# EAGLE design WRO_2025 (EAGLE 9.6.2)
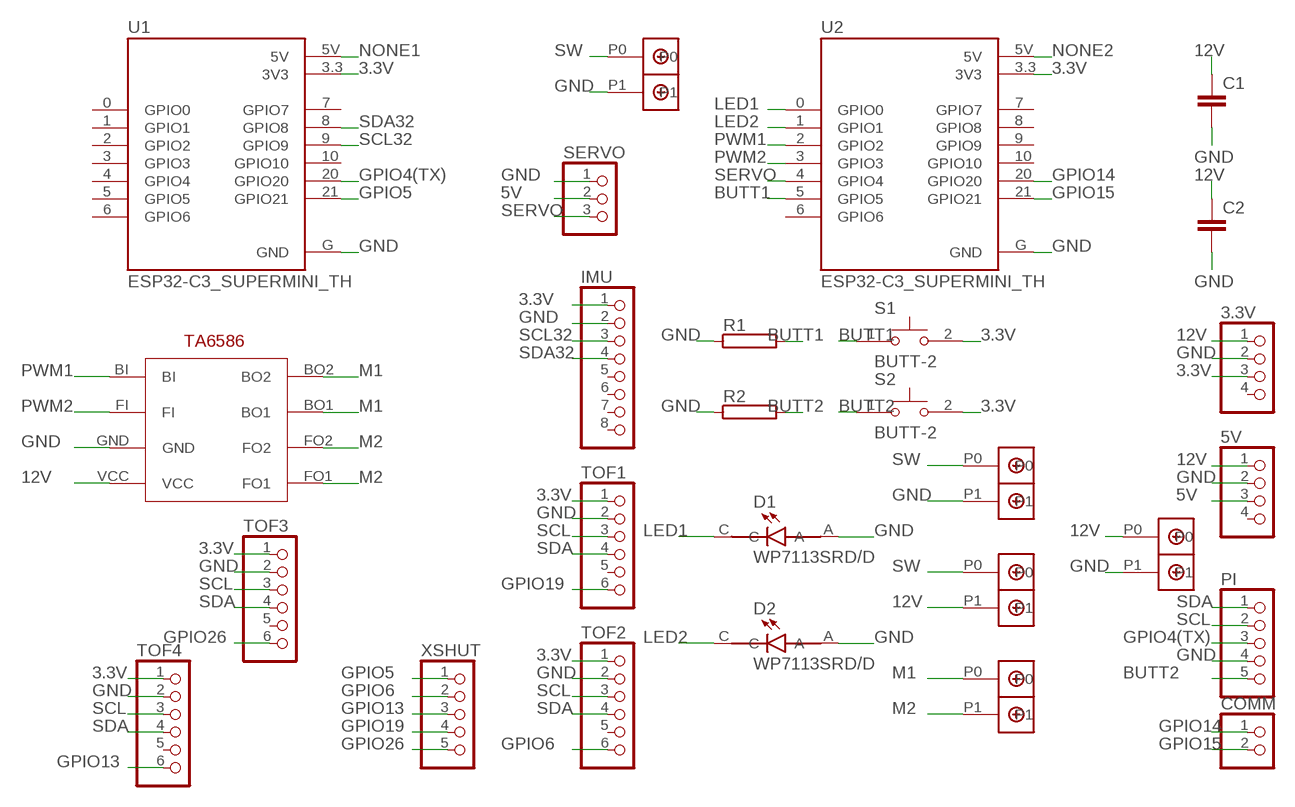
[diagram p0: schematic, sheet 1]

## Parts
3.3V  PINHD-1X4  [1X04]
5V  PINHD-1X4  [1X04]
C1  C2,5-3  [C2.5-3]
C2  C2,5-3  [C2.5-3]
COMM  PINHD-1X2  [1X02]
D1  WP7113SRD/D  [LED_WP7113SRD/D]
D2  WP7113SRD/D  [LED_WP7113SRD/D]
IMU  PINHD-1X8  [1X08]
PI  PINHD-1X5  [1X05]
R1  RHPS58  [HPS58]
R2  RHPS58  [HPS58]
S1  BUTT-2  [SW_BUTT-2]
S2  BUTT-2  [SW_BUTT-2]
SERVO  PINHD-1X3  [1X03]
TOF1  PINHD-1X6  [1X06]
TOF2  PINHD-1X6  [1X06]
TOF3  PINHD-1X6  [1X06]
TOF4  PINHD-1X6  [1X06]
U1  ESP32-C3_SUPERMINI_TH  [MODULE_ESP32-C3_SUPERMINI_TH]
U2  ESP32-C3_SUPERMINI_TH  [MODULE_ESP32-C3_SUPERMINI_TH]
U$1  DBCONN-1X2  [DBCONN-1X2]
U$2  DBCONN-1X2  [DBCONN-1X2]
U$3  DBCONN-1X2  [DBCONN-1X2]
U$4  TA6586  [TA6586-FOOTPRINT]
U$5  DBCONN-1X2  [DBCONN-1X2]
U$6  DBCONN-1X2  [DBCONN-1X2]
XSHUT  PINHD-1X5  [1X05]

## Nets
3.3V: 3.3V.3 IMU.1 S1.2 S2.2 TOF1.1 TOF2.1 TOF3.1 TOF4.1 U1.3.3(3V3) U2.3.3(3V3)
5V: 5V.3 SERVO.2
12V: 3.3V.1 5V.1 C1.1 C2.1 U$2.P1 U$4.VCC U$5.P0
BUTT1: R1.2 S1.1 U2.5(GPIO5)
BUTT2: PI.5 R2.2 S2.1
GND: 3.3V.2 5V.2 C1.2 C2.2 D1.A D2.A IMU.2 PI.4 R1.1 R2.1 SERVO.1 TOF1.2 TOF2.2 TOF3.2 TOF4.2 U1.G(GND) U2.G(GND) U$1.P1 U$4.GND U$5.P1 U$6.P1
GPIO4(TX): PI.3 U1.20(GPIO20)
GPIO5: U1.21(GPIO21) XSHUT.1
GPIO6: TOF2.6 XSHUT.2
GPIO13: TOF4.6 XSHUT.3
GPIO14: COMM.1 U2.20(GPIO20)
GPIO15: COMM.2 U2.21(GPIO21)
GPIO19: TOF1.6 XSHUT.4
GPIO26: TOF3.6 XSHUT.5
LED1: D1.C U2.0(GPIO0)
LED2: D2.C U2.1(GPIO1)
M1: U$3.P0 U$4.BO1 U$4.BO2
M2: U$3.P1 U$4.FO1 U$4.FO2
NONE1: U1.5V
NONE2: U2.5V
PWM1: U2.2(GPIO2) U$4.BI
PWM2: U2.3(GPIO3) U$4.FI
SCL: PI.2 TOF1.3 TOF2.3 TOF3.3 TOF4.3
SCL32: IMU.3 U1.9(GPIO9)
SDA: PI.1 TOF1.4 TOF2.4 TOF3.4 TOF4.4
SDA32: IMU.4 U1.8(GPIO8)
SERVO: SERVO.3 U2.4(GPIO4)
SW: U$1.P0 U$2.P0 U$6.P0
Unconnected: 3.3V.4 5V.4 IMU.5 IMU.6 IMU.7 IMU.8 TOF1.5 TOF2.5 TOF3.5 TOF4.5 U1.0(GPIO0) U1.1(GPIO1) U1.2(GPIO2) U1.3(GPIO3) U1.4(GPIO4) U1.5(GPIO5) U1.6(GPIO6) U1.7(GPIO7) U1.10(GPIO10) U2.6(GPIO6) U2.7(GPIO7) U2.8(GPIO8) U2.9(GPIO9) U2.10(GPIO10)

## Library data of the parts
3.3V 5V = pinhead:PINHD-1X4: PIN HEADER
C1 C2 = capacitor-wima:C: CAPACITOR naming: grid - package width
COMM = pinhead:PINHD-1X2: PIN HEADER
D1 D2 = WP7113SRD_D:WP7113SRD/D: Red T-1 3/4 5 mm 30° Tinted Diffused 600 mcd 1.85 V Solid State LED Through Hole Check availability <https://pricing.snapeda.com/parts/WP7113SRD/D/Kingbright/view-part?ref=eda>; AVAILABILITY: In Stock; CHECK_PRICES: https://www.snapeda.com/parts/WP7113SRD/D/Kingbright/view-part/?ref=eda; DESCRIPTION: Red 640nm LED Indication - Discrete 1.85V Radial; MF: Kingbright; MP: WP7113SRD/D; PACKAGE: Radial Kingbright; PRICE: None; SNAPEDA_LINK: https://www.snapeda.com/parts/WP7113SRD/D/Kingbright/view-part/?ref=snap
IMU = pinhead:PINHD-1X8: PIN HEADER
PI XSHUT = pinhead:PINHD-1X5: PIN HEADER
R1 R2 = resistor-power:R: Power Resitor; OC_FARNELL: unknown; OC_NEWARK: unknown
S1 S2 = BUTT-2:BUTT-2: Tactile Switches MINI PUSH BUTTON SWITCH 2-PIN QTY. 4 Check availability <https://pricing.snapeda.com/parts/BUTT-2/Gravitech/view-part?ref=eda>; AVAILABILITY: Not in stock; CHECK_PRICES: https://www.snapeda.com/parts/BUTT-2/Gravitech/view-part/?ref=eda; DESCRIPTION: Tactile Switches MINI PUSH BUTTON SWITCH 2-PIN QTY. 4; MF: Gravitech; MP: BUTT-2; PACKAGE: None; PRICE: None; SNAPEDA_LINK: https://www.snapeda.com/parts/BUTT-2/Gravitech/view-part/?ref=snap
SERVO = pinhead:PINHD-1X3: PIN HEADER
TOF1-TOF4 = pinhead:PINHD-1X6: PIN HEADER
U1 U2 = ESP32-C3_SUPERMINI_TH:ESP32-C3_SUPERMINI_TH: Check availability <https://pricing.snapeda.com/parts/ESP32-C3%20SuperMini_TH/Espressif%20Systems/view-part?ref=eda>; AVAILABILITY: Not in stock; CHECK_PRICES: https://www.snapeda.com/parts/ESP32-C3%20SuperMini_TH/Espressif+Systems/view-part/?ref=eda; DESCRIPTION: Super tiny ESP32-C3 board; MF: Espressif Systems; MP: ESP32-C3 SuperMini_TH; PACKAGE: Package; PRICE: None; SNAPEDA_LINK: https://www.snapeda.com/parts/ESP32-C3%20SuperMini_TH/Espressif+Systems/view-part/?ref=snap
U$1-U$3 U$5 U$6 = Terminal Block Connector:DBCONN-1X2
U$4 = TA6586:TA6586: Check availability <https://pricing.snapeda.com/parts/TA6586/Wuxi/view-part?ref=eda>; AVAILABILITY: Not in stock; CHECK_PRICES: https://www.snapeda.com/parts/TA6586/Wuxi/view-part/?ref=eda; DESCRIPTION: DC Bidirectional motor driving circuit; MF: Wuxi; MP: TA6586; PACKAGE: Package; PRICE: None; SNAPEDA_LINK: https://www.snapeda.com/parts/TA6586/Wuxi/view-part/?ref=snap

## Board
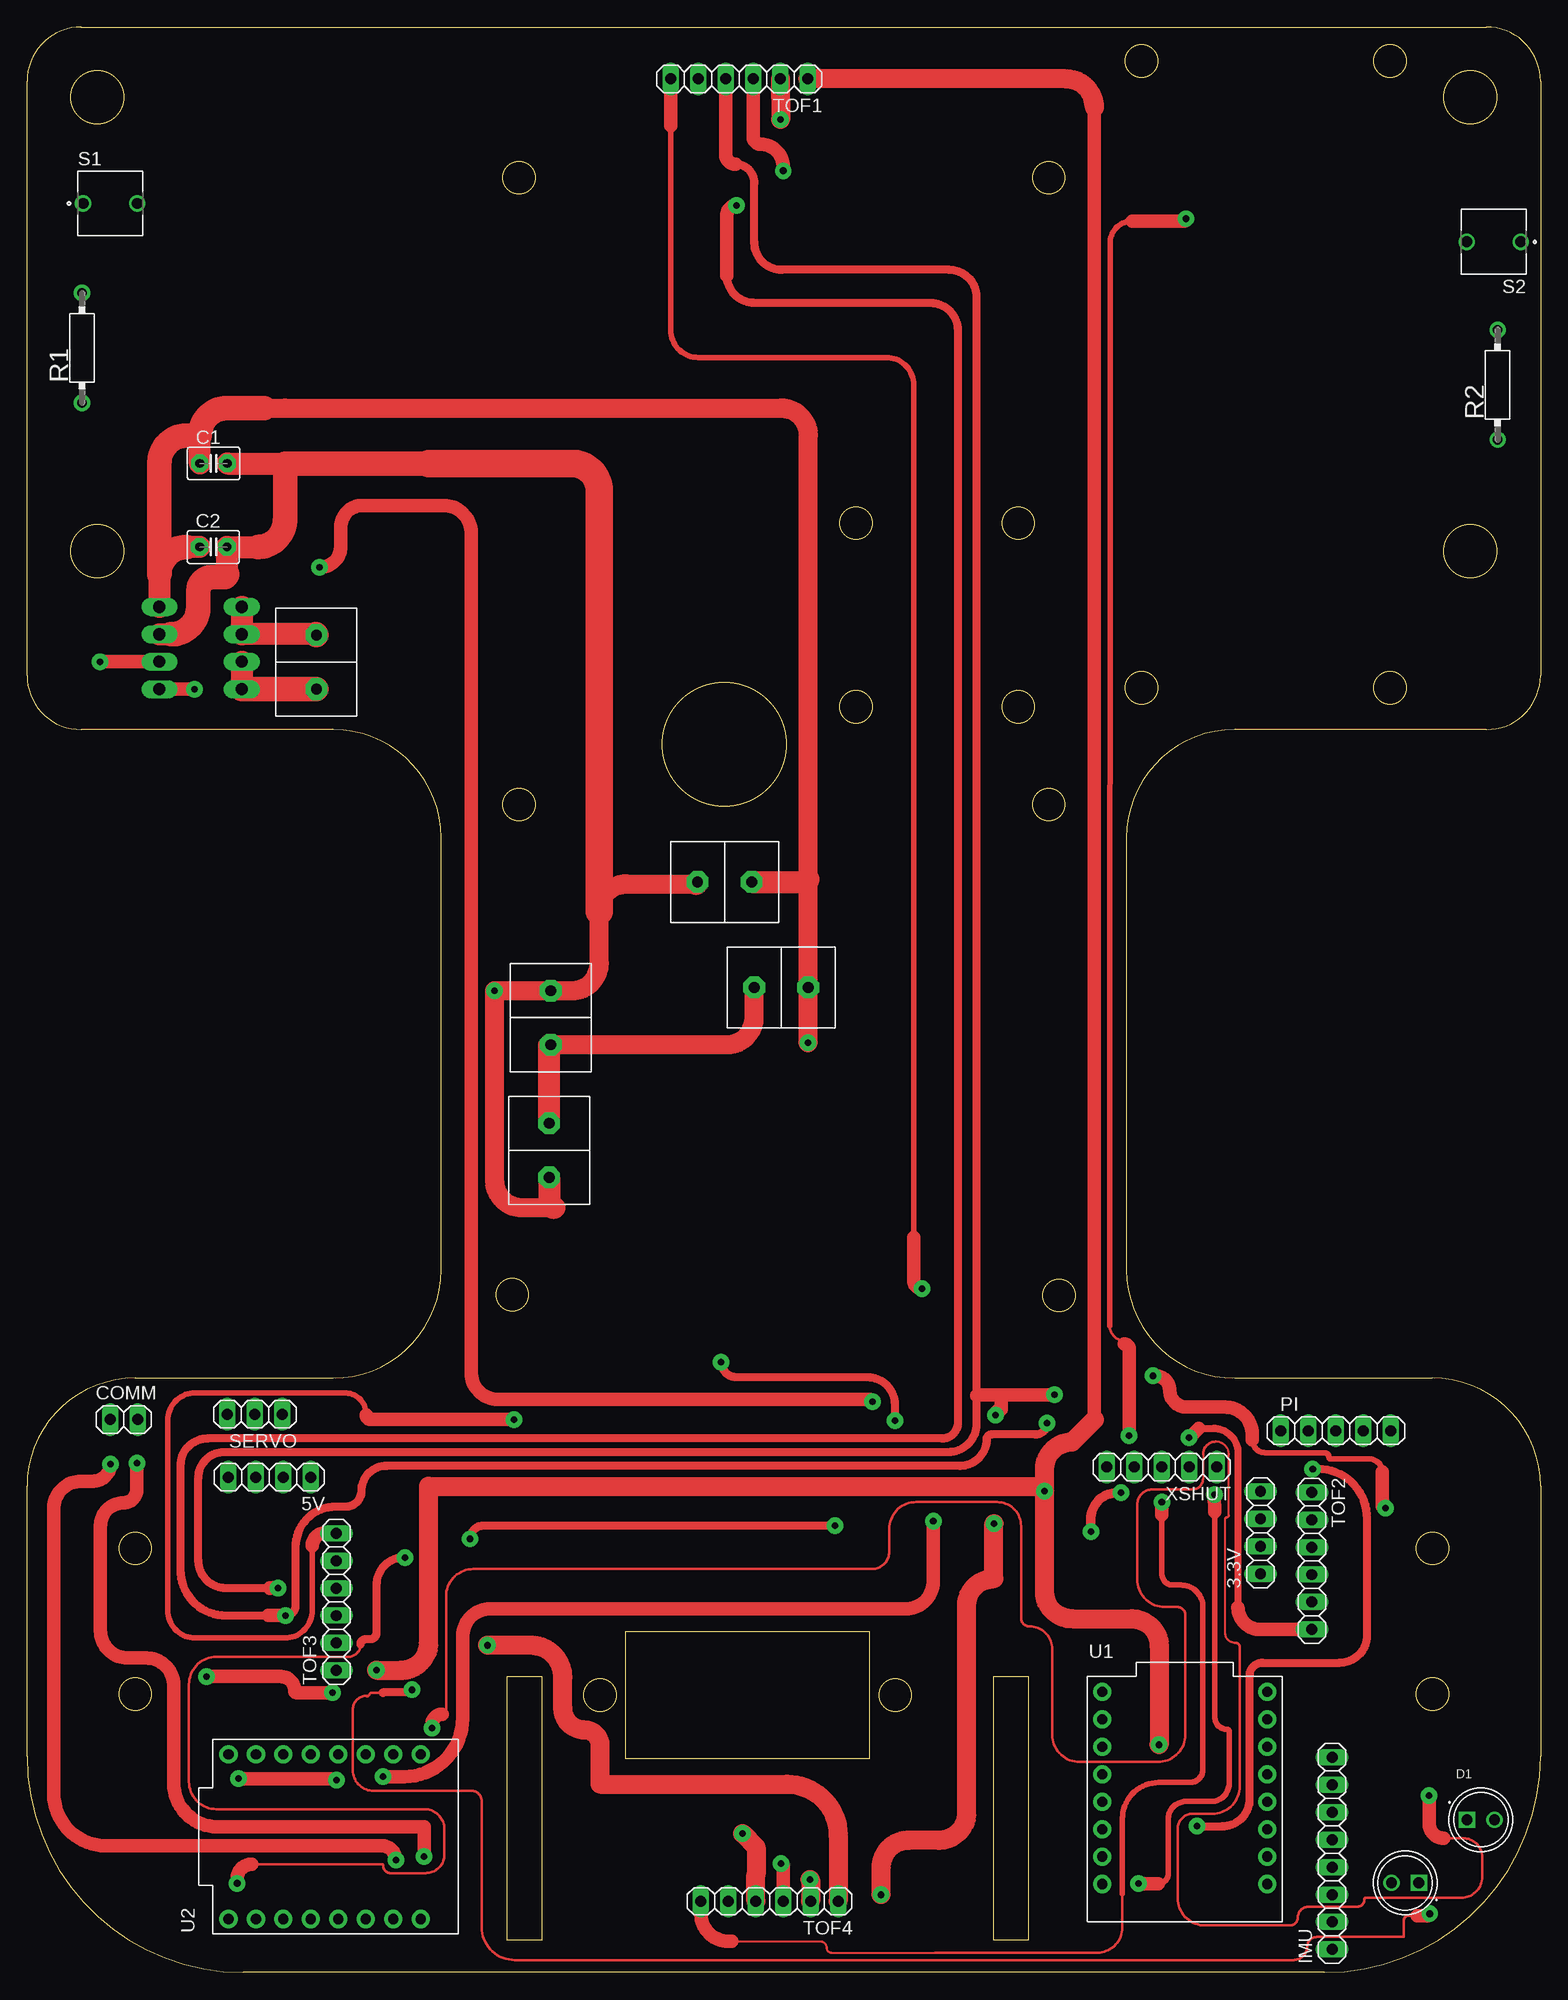
[diagram p1: board, top side]
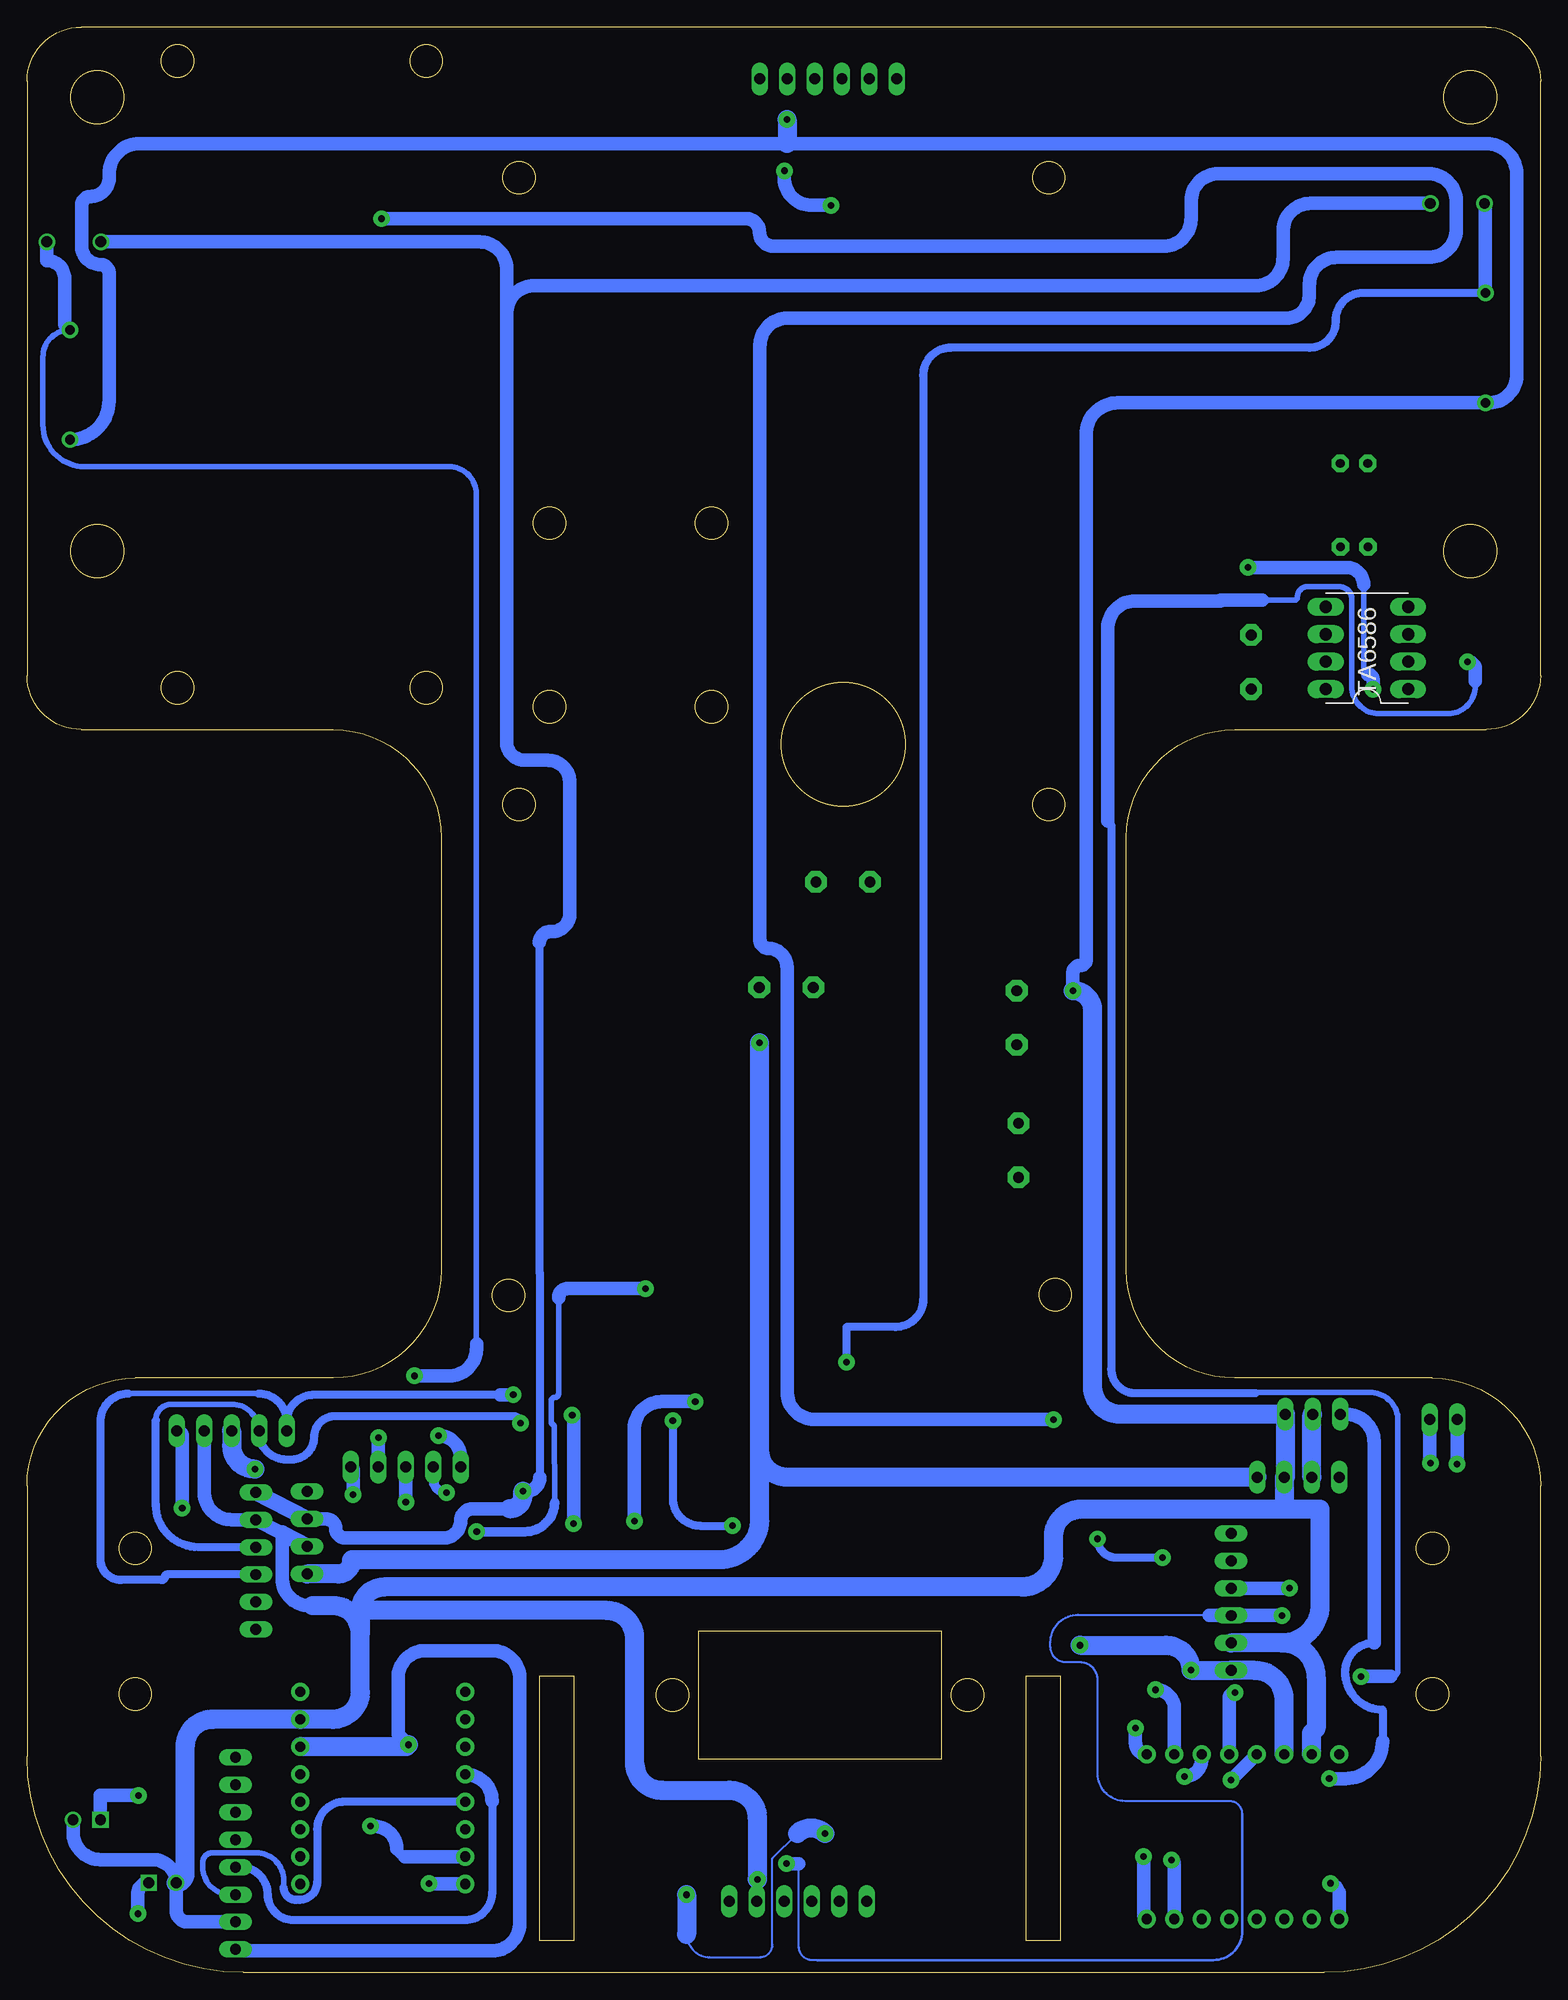
[diagram p2: board, bottom side, seen from below]

Size 140 x 180 mm. Coordinates in mm from the lower left corner, seen from the top.
Outline: 44.4,27.4 47.6,27.4 47.6,3 44.4,3 44.4,27.4
Outline: 89.4,27.4 92.6,27.4 92.6,3 89.4,3 89.4,27.4
Outline: 55.4,31.57 77.9,31.57 77.9,19.77 55.4,19.77 55.4,31.57
Outline: 101.69,105 101.69,65 arc90 111.69,55 130,55 arc-90 140,45 140,20 arc-90 120,0 20,0 arc-90 0,20 0,45 arc-90 10,55 28.31,55 arc90 38.31,65 38.31,105 arc90 28.31,115 5,115 arc-90 0,120 0,175 arc-90 5,180 135,180 arc-90 140,175 140,120 arc-90 135,115 111.69,115 arc90 101.69,105
Outline: circle at 80.3,25.67 radius 1.5
Outline: circle at 130,25.75 radius 1.5
Outline: circle at 10,25.75 radius 1.5
Outline: circle at 10,39.25 radius 1.5
Outline: circle at 103.08,118.86 radius 1.5
Outline: circle at 94.5,166.05 radius 1.5
Outline: circle at 45.5,166.05 radius 1.5
Outline: circle at 130,39.25 radius 1.5
Outline: circle at 133.5,173.5 radius 2.45
Outline: circle at 133.5,131.5 radius 2.45
Outline: circle at 6.5,131.5 radius 2.45
Outline: circle at 6.5,173.5 radius 2.45
Outline: circle at 53,25.67 radius 1.5
Outline: circle at 126.08,176.86 radius 1.5
Outline: circle at 45.5,108.05 radius 1.5
Outline: circle at 126.08,118.86 radius 1.5
Outline: circle at 91.68,117.1 radius 1.5
Outline: circle at 76.68,134.1 radius 1.5
Outline: circle at 91.68,134.1 radius 1.5
Outline: circle at 103.08,176.86 radius 1.5
Copper layers (1*16): Top 0.035mm / dielectric 1.5mm / Bottom 0.035mm
Design rules "default *": minimum track width 6mil, minimum drill 0.35mm, track to track 0.4mm, track to pad 0.4mm, pad to pad 6mil, via to via 6mil, smd to smd 6mil, copper to edge 40mil, drill to drill 6mil, minimum pad ring 10mil, minimum via ring 8mil, stop-mask expansion 4mil, vias tented up to drill 0mil, thermal gap 10mil

### Footprints (pad centres in the part's own frame; a part is rotated, then mirrored left to right if it is on the bottom)
1X04 = drill 1.016 long: 1 -3.81,0; 2 -1.27,0; 3 1.27,0; 4 3.81,0
C2.5-3 = drill 0.813 pad 1.6 octagon: 1 -1.27,0; 2 1.27,0
1X02 = drill 1.016 long: 1 -1.27,0; 2 1.27,0
LED_WP7113SRD/D = drill 1: A 1.27,0 | drill 1 square: C -1.27,0
1X08 = drill 1.016 long: 1 -8.89,0; 2 -6.35,0; 3 -3.81,0; 4 -1.27,0; 5 1.27,0; 6 3.81,0; 7 6.35,0; 8 8.89,0
1X05 = drill 1.016 long: 1 -5.08,0; 2 -2.54,0; 3 0,0; 4 2.54,0; 5 5.08,0
HPS58 = drill 0.9 pad 1.5: 1 -5.08,0; 2 5.08,0
SW_BUTT-2 = drill 1: 1 -2.5,0; 2 2.5,0
1X03 = drill 1.016 long: 1 -2.54,0; 2 0,0; 3 2.54,0
1X06 = drill 1.016 long: 1 -6.35,0; 2 -3.81,0; 3 -1.27,0; 4 1.27,0; 5 3.81,0; 6 6.35,0
MODULE_ESP32-C3_SUPERMINI_TH = drill 0.94 pad 1.676: 0 7.62,-7.88; 1 7.62,-5.34; 2 7.62,-2.8; 3 7.62,-0.26; 3.3 7.62,4.82; 4 7.62,2.28; 5 -7.62,9.9; 5V 7.62,9.9; 6 -7.62,7.36; 7 -7.62,4.82; 8 -7.62,2.28; 9 -7.62,-0.26; 10 -7.62,-2.8; 20 -7.62,-5.34; 21 -7.62,-7.88; G 7.62,7.36
DBCONN-1X2 = drill 1 pad 2 octagon: P0 -2.54,0; P1 2.46,0
TA6586-FOOTPRINT = drill 1.118 long: BI -12.7,6.35; BO1 -5.08,3.81; BO2 -5.08,6.35; FI -12.7,3.81; FO1 -5.08,-1.27; FO2 -5.08,1.27; GND -12.7,1.27; VCC -12.7,-1.27

### Placement (x,y rotation side)
3.3V  114.1,40.69 90 top
5V  22.42,45.83 180 top
C1  17.25,139.62 0 top
C2  17.23,131.89 0 top
COMM  8.96,51.17 0 top
D1  134.48,14.14 0 top
D2  127.48,8.29 180 top
IMU  120.72,11.02 90 top
PI  121.07,50.11 0 top
R1  5.09,150.31 90 top
R2  136.03,146.9 90 top
S1  7.69,163.68 0 top
S2  135.67,160.12 180 top
SERVO  21.07,51.64 180 top
TOF1  65.89,175.2 180 top
TOF2  118.84,38.08 270 top
TOF3  28.61,34.29 90 top
TOF4  68.68,6.59 180 top
U1  107.09,16.06 0 top
U2  28.53,12.57 90 top
U$1  48.45,88.38 90 top
U$2  69.81,91.14 0 top
U$3  26.77,121.29 90 top
U$4  24.95,125.08 180 bottom
U$5  64.48,100.9 180 top
U$6  48.29,76.03 270 top
XSHUT  104.96,46.76 180 top

### Tracks (layer width: path | path; a pad name or v marks a point on that pad's centre or on a via)
3.3V  (via drill 0.61 pad 1.52)
  Top 1.27: 98.73,51.13 98.73,172.57
  Top 1.778: 98.73,51.13 96.68,49.08 arc-90 96.66,49.08 arc90 94.13,46.55 v94.13,44.54 | v104.72,21.07 v104.73,21.08 104.73,30.18 arc90 102.19,32.72 96.67,32.72 arc-90 94.13,35.26 v94.13,44.54 | 98.73,172.57 arc90 96.1,175.2 TOF1.1 | TOF4.1 75.03,12.69 arc90 70.29,17.43 53.02,17.43 53.02,21 arc90 51.59,22.43 arc-90 49.56,24.46 49.56,27.32 arc90 46.61,30.27 v42.59,30.27 | 37.15,30.5 arc-90 34.6,27.96 | v32.33,27.96 34.6,27.96 | 34.6,27.96 arc90 37.15,30.5 | 37.15,30.5 37.15,44.98 93.68,44.98 arc-90 v94.13,44.54
  Bottom 0.762: 92.61,95.29 92.61,64.76 92.57,64.72 92.57,45.8 92.61,45.76
  Bottom 1.27: S1.2 21.28,163.68 arc-90 23.82,161.14 23.82,158.62 arc90 26.36,156.08 93.09,156.08 arc-90 95.63,153.54 | 95.63,153.54 95.63,113.85 arc-90 93.94,112.16 91.86,112.16 arc90 89.79,110.08 89.79,98 arc90 91.48,96.31 91.59,96.31 arc-90 92.61,95.29 | S2.2 98.17,160.12 arc90 95.63,157.58 95.63,153.54 | IMU.1 arc-90 120.58,2 96.97,2 arc-90 94.44,4.54 94.44,27.24 arc-90 96.97,29.78 103.14,29.78 arc-90 105.68,27.24 105.68,22.03 v104.72,21.07 | 95.36,42.9 98.76,42.9 arc-90 99.9,41.77 arc90 101.46,40.2 110.59,40.2 arc90 111.45,41.06 arc-90 112.35,41.96 3.3V.3 | 92.57,45.8 arc90 93.87,44.5 94.13,44.5
  Bottom 1.524: 3.3V.3 TOF2.1
  Bottom 1.778: U2.3.3 23.71,25.25 arc-90 26.41,27.94 TOF3.1 arc-90 28.64,27.96 v32.33,27.96 arc-90 34.64,30.27 v42.59,30.27 | v104.72,21.07 arc-90 104.9,20.88 U1.3.3 | 95.36,42.9 arc-90 94.13,44.13 94.13,44.5 v94.13,44.54
5V
  Bottom 1.778: 5V.3 21.14,51.57 arc90 SERVO.2
12V  (via drill 0.61 pad 1.52)
  Top 1.778: v72.24,86.03 72.24,91.12 arc-90 U$2.P1 72.27,101.16 72.27,142.21 arc90 69.73,144.75 23.86,144.75 21.94,144.75 21.06,144.75
  Top 2.032: U$5.P0 72.01,100.9 arc90 72.27,101.16 | C1.1 15.98,142.21 | C2.1 14.79,131.9 | 12.24,129.35 U$4.VCC
  Top 2.286: 21.94,144.75 18.52,144.75 arc90 15.98,142.21 14.79,142.21 arc90 12.24,139.67 12.24,129.35 arc-90 14.79,131.9
  Bottom 1.778: 5V.1 69.7,45.83 arc90 72.24,48.37 | 72.24,48.37 v72.24,86.03 | 72.24,48.37 72.24,41.9 arc90 75.96,38.18 109.9,38.18 arc-90 109.98,38.09 arc90 111.2,36.88 3.3V.1
BUTT1  (via drill 0.61 pad 1.52)
  Top 0.254: 30.83,30.32 arc-90 29.71,29.21 17.52,29.21 arc90 14.98,26.66 14.98,17.66 arc90 17.52,15.11 36.76,15.11 arc-90 38.62,13.26 38.62,10.94 arc-90 36.87,9.2 33.63,9.2 arc-90 32.94,9.89 arc90 32.8,10.03 20.79,10.03
  Top 0.762: v64.21,56.48 arc90 65.61,55.08 77.73,55.08 arc-90 80.27,52.54 v80.27,51.06 | v74.73,41.34 42.2,41.34 arc90 v40.98,40.12 | v34.95,38.4 34.86,38.4 arc90 32.32,35.85 32.32,31.43 arc-90 31.73,30.83 31.34,30.83 arc90 30.83,30.32
  Top 1.27: 20.79,10.03 arc90 19.44,8.68 v19.44,8.25
  Bottom 0.762: R1.2 16.42,155.39 arc-90 18.96,152.85 18.96,152.73 arc90 21.36,150.33 54.57,150.33 arc-90 57.11,147.79 57.11,62.27 arc90 59.65,59.73 64.21,59.73 v64.21,56.48 | v80.27,51.06 80.27,43.88 arc-90 77.73,41.34 v74.73,41.34 | v40.98,40.12 arc-90 39.26,38.4 v34.95,38.4
  Bottom 1.016: v19.44,8.25 arc90 18.63,7.44
  Bottom 1.27: R1.2 5.09,163.58 arc-90 S1.1 | 18.63,7.44 U2.5
BUTT2  (via drill 0.61 pad 1.52)
  Top 0.508: 113.33,49.29 arc90 114.53,48.09 119.98,48.09 arc-90 120.44,47.64 arc90 120.54,47.53 124.13,47.53 arc-90 125.36,46.3
  Top 1.27: v104.15,55.2 104.36,55.2 arc-90 105.7,53.86 arc90 107.25,52.31 110.79,52.31 arc-90 113.33,49.77 113.33,49.29 | 125.36,46.3 125.36,43.24 arc90 v125.64,42.96
  Bottom 0.508: R2.2 arc-90 138.53,149.48 138.53,143.19 arc-90 134.67,139.32 100.96,139.32 arc90 98.44,136.81 98.44,58.17 98.42,58.14
  Bottom 1.27: R2.2 136.52,152.47 136.52,156.74 arc-90 138.17,158.39 S2.1 | 98.42,58.14 98.42,57.74 arc90 100.96,55.2 v104.15,55.2 | v125.64,42.96 125.64,49.61 arc-90 PI.5
GND  (via drill 0.61 pad 1.52)
  Top 1.778: 48.78,70.75 45.8,70.75 arc-90 43.26,73.29 v43.26,90.85 U$1.P1 arc-90 U$1.P1 50.39,90.84 arc90 52.93,93.38 52.93,98.18 arc-90 55.47,100.72 61.84,100.72 | TOF1.2 v69.7,171.43 | v72.44,8.61 72.49,8.56 TOF4.2
  Top 2.032: 61.84,100.72 arc90 U$5.P1 | U$6.P1 48.29,71.23 arc90 48.78,70.75 | C1.2 23.86,139.62 | 21.32,131.9 C2.2 18.5,129.4 | U$4.GND 13.32,123.81
  Top 2.286: 37.14,139.62 23.86,139.62 23.86,134.44 arc-90 21.32,131.9 | 13.32,123.81 arc90 15.86,126.35 15.86,127.87 arc-90 17.07,129.08 18.19,129.08 arc90 18.5,129.4
  Top 2.54: 37.14,139.62 50.39,139.62 arc-90 52.93,137.08 52.93,98.18
  Bottom 1.27: v43.26,90.85 43.26,92.47 arc90 42.55,93.18 arc-90 42.04,93.7 42.04,142.3 arc90 39.11,145.23 R1.1 4.75,145.23 arc-90 2.21,147.77 2.21,166.41 arc-90 5.01,169.21 69.7,169.21 129.61,169.21 arc-90 132.41,166.41 132.41,166.02 arc90 134.1,164.32 arc-90 134.95,163.47 134.95,159.75 arc-90 133.22,158.02 arc90 132.41,157.2 132.41,145.44 arc90 R2.1 | 113.58,33.94 113.87,33.94 arc90 116.41,36.48 116.41,40.63 TOF2.2 121.07,41.89 arc90 123.61,44.43 PI.4 | IMU.2 125.12,4.67 arc90 126.21,5.76 D2.A arc-90 128.36,10.44 133.21,10.44 arc90 135.75,12.98 D1.A
  Bottom 1.524: 3.3V.2 116.41,40.63
  Bottom 1.778: 23.93,30.48 TOF3.2 | 23.69,42.88 5V.2 arc-90 23.61,45.9 SERVO.1 38.86,51.64 arc90 41.43,54.22 41.43,89.02 arc-90 v43.26,90.85 | 23.93,30.48 arc-90 20.4,34.01 20.4,42.88 23.69,42.88 | U2.G 21.17,22.16 20.75,22.58 20.75,27.37 arc-90 23.87,30.48 23.93,30.48 | 23.69,42.88 42.5,42.88 arc-90 45.04,40.34 45.04,38.56 arc90 47.95,35.66 107,35.66 arc-90 109.18,33.48 | D2.A arc-90 125.39,9.12 125.39,20.88 arc90 122.84,23.42 U1.G 111.72,23.42 arc-90 109.18,25.96 109.18,31.4 | 109.18,31.4 arc-90 111.72,33.94 113.58,33.94 | 109.18,33.48 109.18,31.4 | 109.18,33.48 86.34,33.48 arc90 83.8,30.94 83.8,19.4 arc-90 81.26,16.86 75,16.86 arc90 72.46,14.32 72.46,8.64 v72.44,8.61 | v69.7,171.43 69.7,169.21
GPIO4(TX)  (via drill 0.61 pad 1.52)
  Top 0.762: v108.24,13.53 110.56,13.53 arc90 113.1,16.07 113.1,27.48 arc-90 114.29,28.67 121.42,28.67 arc90 123.97,31.21 123.97,42.03 arc90 119.4,46.59 v118.92,46.59
  Bottom 0.762: 105.06,10.72 arc90 105.8,11.46
  Bottom 1.27: U1.20 105.06,10.72 | 105.8,11.46 arc-90 107.87,13.53 v108.24,13.53
  Bottom 1.778: PI.3 121.07,48.74 arc-90 v118.92,46.59
GPIO5  (via drill 0.61 pad 1.52)
  Top 0.508: 109.88,42.61 109.88,23.6 arc90 110.98,22.5 arc-90 111.2,22.28 111.2,17.48 arc-90 109.54,15.83 107.21,15.83 arc90 105.56,14.18 105.56,9.15 arc-90 104.64,8.23
  Top 1.27: v102.81,8.23 104.64,8.23 | 109.88,42.61 109.85,42.63 v109.83,44.2
  Bottom 1.27: v102.81,8.23 99.52,8.23 arc90 U1.21 | XSHUT.1 109.81,46.53 v109.83,44.2
GPIO6  (via drill 0.61 pad 1.52)
  Top 0.635: 108.37,50.35 109.73,50.35 arc-90 112.01,48.06 112.01,33.81
  Top 1.27: v107.49,49.47 108.37,50.35 | 112.01,33.81 arc90 114.09,31.73 TOF2.6
  Bottom 1.27: XSHUT.2 v107.49,49.47
GPIO13  (via drill 0.61 pad 1.52)
  Top 0.178: 65.19,2.89 73.35,2.89 arc-90 73.97,2.27 arc90 74.41,1.83 84,1.83
  Top 0.254: 101.32,7.26 101.32,4.16 arc-90 98.99,1.83 84,1.83
  Top 0.508: 104.97,42.34 104.97,36.87 arc90 105.99,35.84 106.74,35.84 arc-90 108.77,33.81 108.77,18.78 arc-90 107.56,17.58 104.68,17.58 arc90 101.32,14.21 101.32,7.26
  Top 1.27: v104.97,43.51 104.97,42.34 | TOF4.6 62.33,5.43 arc90 64.87,2.89 65.19,2.89
  Bottom 1.27: v104.97,43.51 XSHUT.3
GPIO14  (via drill 0.61 pad 1.52)
  Top 1.27: v34.12,10.39 arc90 32.79,11.72 7.32,11.72 arc-90 2.46,16.58 2.46,42.92 arc-90 5,45.46 6.13,45.46 arc90 v7.72,47.04
  Bottom 1.27: v34.12,10.39 33.87,10.14 U2.20 | v7.72,47.04 7.72,51.14 arc90 COMM.1
GPIO15  (via drill 0.61 pad 1.52)
  Top 1.27: v10.16,47.11 10.16,44.68 arc-90 8.93,43.45 arc90 6.79,41.31 6.79,31.63 arc90 9.33,29.09 11.03,29.09 arc-90 13.57,26.55 13.57,17.5 arc90 17.59,13.48 36.73,13.48 v36.73,10.75
  Bottom 1.27: COMM.2 10.23,47.18 arc-90 v10.16,47.11 | v36.73,10.75 36.73,5.26 U2.21
GPIO19  (via drill 0.61 pad 1.52)
  Top 0.508: 59.55,170.89 59.55,151.96 arc90 62.09,149.42 79.48,149.42 arc-90 82.02,146.88 82.02,67.99
  Top 0.889: v98.41,40.78 98.41,41.95 arc-90 100.84,44.39 v101.19,44.39
  Top 1.27: TOF1.6 59.55,170.89 | 82.02,67.99 82.02,64.03 arc90 v82.78,63.27
  Bottom 0.508: 90.83,62.41 90.83,53.54 arc90 91.16,53.22 arc-90 91.5,52.87 91.5,50.84 91.22,50.55 91.2,43.51
  Bottom 0.889: 91.2,43.51 arc90 93.92,40.78 v98.41,40.78 | v101.19,44.39 arc90 102.42,45.62 XSHUT.4
  Bottom 1.27: v82.78,63.27 89.97,63.27 arc-90 90.83,62.41
GPIO26  (via drill 0.61 pad 1.52)
  Top 0.254: 101.49,58.49 arc-90 100.14,59.83
  Top 0.508: 101.49,58.14 101.49,58.49 | 100.14,59.83 100.19,160.01 arc-90 102.22,162.05 | 31.39,51.59 arc90 29.34,53.64 15.56,53.64 arc90 13.02,51.09 13.02,33.49 arc90 15.56,30.95 23.84,30.95 arc90 26.38,33.49 26.38,39.49
  Top 1.27: v101.94,49.68 101.94,57.68 arc90 101.49,58.14 | 102.22,162.05 106.99,162.05 arc90 v107.21,162.27 | v45.04,51.17 31.8,51.17 arc-90 31.39,51.59 | 26.38,39.49 arc-90 27.53,40.64 TOF3.6
  Bottom 1.27: XSHUT.5 99.88,47.61 arc-90 v101.94,49.68 | v107.21,162.27 73.49,162.27 arc90 72.25,161.02 arc-90 70.94,159.71 34.87,159.71 arc-90 32.33,162.25 32.33,163.89 arc90 29.79,166.43 10.35,166.43 arc90 7.81,163.89 7.81,161.23 arc90 10.35,158.69 18.84,158.69 arc-90 21.38,156.15 21.38,155.19 arc90 23.5,153.07 69.66,153.07 arc-90 72.2,150.53 72.2,95.5 arc-90 71.46,94.76 arc90 69.7,93 69.7,53.71 arc-90 67.16,51.17 v45.04,51.17
LED1  (via drill 0.61 pad 1.52)
  Top 0.178: 111.7,30.52 arc-90 110.83,31.39 110.83,41.97 arc-90 110.99,42.13 arc90 111.17,42.31 111.17,47.9 arc90 109.96,49.12 | 108.78,47.94 108.78,45.67
  Top 0.254: 131.06,12.42 132.88,12.42 arc-90 134.6,10.69 134.6,8.84 arc-90 132.68,6.92 123.89,6.92 arc90 123.7,6.73 arc-90 123.07,6.09 118.56,6.09 arc90 117.55,5.07 arc-90 116.82,4.35 108.97,4.35 arc-90 106.43,6.89 106.43,13.29 arc-90 107.82,14.69 109.63,14.69 arc90 112.17,17.23 112.17,30.1 arc90 111.75,30.52 111.7,30.52 | 109.96,49.12 arc90 108.78,47.94 | 108.78,45.67 arc-90 107.81,44.69 104.09,44.69 arc90 102.7,43.31 102.7,36.35 arc90 105.24,33.81 106.4,33.81 arc-90 107.15,33.07 107.15,22.01 arc-90 104.61,19.47 97.36,19.47 arc-90 94.82,22.01 94.82,29.94 arc90 92.75,32.01 arc-90 91.95,32.81 91.95,41.32 arc90 89.75,43.53 82.24,43.53 arc90 79.75,41.04 79.75,38.93 arc-90 78.15,37.33 41.3,37.33 arc90 38.76,34.79 38.76,24.25 arc-90 38.42,23.91
  Top 1.27: v129.69,16.39 129.69,13.78 arc90 131.06,12.42 | 38.42,23.91 arc90 37.47,22.96 v37.47,22.61
  Bottom 1.27: D1.C 133.21,16.39 v129.69,16.39 | v37.47,22.61 37.47,21.24 arc-90 U2.0
LED2  (via drill 0.61 pad 1.52)
  Top 0.254: 32.92,25.87 31.81,25.87 31.54,25.6 arc-90 31.41,25.6 arc90 30.14,24.33 30.14,18.71 arc90 32.05,16.81 41.12,16.81 arc-90 42.05,15.88 42.05,4.2 arc90 45.1,1.15 117.16,1.15 arc90 118.42,2.41 arc-90 119.29,3.28 127.36,3.28 127.36,4.84 arc-90 127.78,5.26 128.59,5.26
  Top 0.762: v35.6,26.16 35.34,25.9 32.89,25.9 32.92,25.87
  Top 1.27: 128.59,5.26 129.58,5.26 arc90 v129.75,5.43
  Bottom 1.27: v129.75,5.43 129.75,7.29 arc90 D2.C | v35.6,26.16 arc90 33.87,24.43 U2.1
M1
  Top 2.032: U$4.BO1 U$4.BO2
  Top 2.286: U$3.P0 arc-90 26.76,118.73 U$4.BO2
M2
  Top 2.032: U$4.FO1 U$4.FO2 26.71,123.81
  Top 2.286: U$3.P1 arc90 26.71,123.81
PWM1  (via drill 0.61 pad 1.52)
  Top 1.27: v78.19,52.82 77.98,53.03 43.55,53.03 arc-90 41.08,55.5 41.08,133.19 arc90 38.54,135.73 31.02,135.73 arc90 29.03,133.74 29.03,131.97 arc-90 v27.05,130 | v83.83,41.77 83.83,36.19 arc-90 81.29,33.65 42.84,33.65 arc90 40.3,31.11 40.3,23.52 arc-90 34.9,18.12 v32.94,18.12 | v15.49,118.73 U$4.BI
  Bottom 0.508: 16.36,128.43 16.36,120.62 15.99,120.25 arc-90 15.99,120.1
  Bottom 1.27: v78.19,52.82 81.29,52.82 arc-90 83.83,50.28 v83.83,41.77 | U2.2 31.33,19.72 arc90 v32.94,18.12 | v27.05,130 17.93,130 arc90 16.36,128.43 | 15.99,120.1 arc90 15.49,119.59 v15.49,118.73
PWM2  (via drill 0.61 pad 1.52)
  Top 1.27: v28.25,25.9 24.95,25.9 arc-90 24.77,26.07 arc90 23.46,27.38 v16.6,27.38 | v6.74,121.28 12.23,121.28 arc-90 U$4.FI
  Bottom 0.508: 26.37,53.6 26.3,53.68 15.8,53.68 arc90 13.19,51.06 13.19,28.03 arc90 13.83,27.38 | 25.73,126.95 22.8,126.95 arc-90 22.49,127.26 arc90 21.53,128.22 18.62,128.22 arc90 17.45,127.06 17.45,118.98 arc-90 14.94,116.47 8.57,116.47 arc-90 6.03,119.01 6.03,119.51
  Bottom 0.762: 40.03,106.53 39.71,106.21 39.71,55.82 arc-90 37.49,53.6 26.37,53.6
  Bottom 1.27: 40.03,106.53 40.03,124.36 arc90 37.49,126.9 29.64,126.9 arc90 29.58,126.95 25.73,126.95 | 13.83,27.38 v16.6,27.38 | v28.25,25.9 arc-90 28.79,25.35 U2.3 | 6.03,119.51 6.03,120.57 arc-90 v6.74,121.28
SCL  (via drill 0.61 pad 1.52)
  Top 0.762: 64.74,157.01 arc90 67.28,154.47 83.56,154.47 arc-90 86.1,151.93 86.1,50.87 arc-90 84.63,49.4 16.68,49.4 arc90 14.19,46.9 14.19,37.24 arc90 18.4,33.03 22.29,33.03 | v94.36,50.83 arc-90 93.3,49.77 89.2,49.77 arc90 88.76,49.34 arc-90 86.3,46.87 33.24,46.87 arc90 30.92,44.55 arc-90 29.46,43.09 28.53,43.09 arc90 24.83,39.39 24.83,33.94 arc-90 v23.92,33.03
  Top 1.27: 22.29,33.03 v23.92,33.03 | 64.74,157.01 64.74,162.59 arc-90 v65.64,163.5 | v69.95,166.7 69.95,167.08 arc90 67.88,169.15 arc-90 67.16,169.88 TOF1.3 | v69.76,10.07 arc-90 69.95,9.88 TOF4.3
  Bottom 0.178: 66.9,1.15 67.38,1.15 arc90 68.6,2.37 68.6,10.07 | 69.95,6.56 TOF4.3 | 27.59,14.69 arc-90 28.76,15.85 38.42,15.85 arc90 40.96,18.4 40.96,27.06 arc-90 42.6,28.7 43.91,28.7 arc90 45.33,30.12 45.33,30.56 arc90 42.79,33.1 28.69,33.1 arc90 TOF3.3
  Bottom 0.254: 27.59,14.69 27.59,3.81 arc90 30.25,1.15 66.9,1.15
  Bottom 0.508: 128.09,51.12 arc90 126.63,52.57 121.07,52.57 arc90 118.53,50.03
  Bottom 0.762: v94.36,50.83 arc-90 94.99,51.47 111.52,51.47 arc-90 113.46,49.53 arc90 115.54,47.45 115.99,47.45 arc90 118.53,49.99 118.53,50.03 PI.2 | TOF2.3 124.15,39.35 arc90 128.09,43.28 128.09,51.12
  Bottom 1.27: v23.92,33.03 TOF3.3 arc90 TOF3.3 30.64,33.02 | v65.64,163.5 67.41,163.5 arc90 69.95,166.03 v69.95,166.7 | v69.76,10.07 68.6,10.07
SCL32
  Bottom 0.508: 116.26,7.88 116.26,8.53 arc-90 118.8,11.07 122.86,11.07 arc-90 123.74,10.19 123.74,9.75 arc-90 121.2,7.21 IMU.3
  Bottom 0.762: U1.9 110.62,15.8 arc-90 113.16,13.26 113.16,8.36 arc90 114.8,6.72 115.11,6.72 arc90 116.26,7.88
SDA  (via drill 0.61 pad 1.52)
  Top 0.762: 22.44,35.56 18.4,35.56 arc-90 15.86,38.1 15.86,45.79 arc-90 18.23,48.16 85.23,48.16 arc90 87.84,50.76 87.84,53.33 87.84,154.99 arc90 85.3,157.53 69.82,157.53 arc-90 67.28,160.07 67.28,165.57 arc90 65.56,167.29
  Top 1.27: v23.22,35.56 23.19,35.59 22.47,35.59 22.44,35.56 | v95.02,53.45 90.11,53.45 | 90.11,53.45 87.96,53.45 arc90 87.84,53.33 | v89.57,51.56 arc-90 90.11,52.1 90.11,53.45 | 65.56,167.29 arc-90 64.61,168.24 TOF1.4
  Top 1.778: v89.44,41.52 89.44,36.43 arc90 86.91,33.91 86.91,14.77 arc-90 84.37,12.23 81.53,12.23 arc90 78.99,9.69 v78.99,7.19 | v66.19,12.85 67.45,11.59 67.45,9.07 67.41,9.03 TOF4.4
  Bottom 0.178: 78.99,3.55 arc-90 76.85,1.41 72.21,1.41 arc-90 71.05,2.58 71.05,10.55 68.77,12.83 arc90 68.74,12.85
  Bottom 0.508: 130.6,53.57 118.59,53.57
  Bottom 0.762: 96.22,53.45 113.45,53.45 arc-90 115.99,50.91 PI.1 115.99,50.98 arc-90 118.59,53.57 | 130.6,53.57 arc-90 133.19,50.98 133.19,38.21 arc-90 131.29,36.31 127.57,36.31 arc-90 127.23,36.65 arc90 127.07,36.81 TOF2.4
  Bottom 1.27: TOF3.4 v23.22,35.56 | v95.02,53.45 96.22,53.45 | v89.44,41.52 89.44,51.43 arc-90 v89.57,51.56
  Bottom 1.778: v78.99,7.19 78.99,3.55 arc90 79.02,3.53 | 66.21,12.87 v66.19,12.85 arc-90 68.74,12.85
SDA32
  Bottom 0.762: 96.99,15.86 96.99,7.38 arc90 99.53,4.84 115.35,4.84 arc90 117.72,7.21 117.72,7.21 arc-90 120.26,9.75 IMU.4
  Bottom 1.27: U1.8 arc90 96.99,15.86
SERVO  (via drill 0.61 pad 1.52)
  Top 1.27: v19.55,17.94 28.48,17.94 arc90 v28.62,17.8
  Bottom 0.762: 15.39,30.49 arc-90 18.09,27.8 arc-90 14.61,24.32 14.61,21.38
  Bottom 1.27: SERVO.3 17.93,51.64 arc90 15.39,49.1 15.39,30.49 | 14.61,21.38 arc90 18.06,17.94 v19.55,17.94 | U2.4 28.62,17.82 v28.62,17.8
SW
  Top 1.778: U$1.P0 64.73,85.84 arc90 67.27,88.38 U$2.P0
  Top 2.032: U$6.P0 48.29,85.69 arc-90 U$1.P0